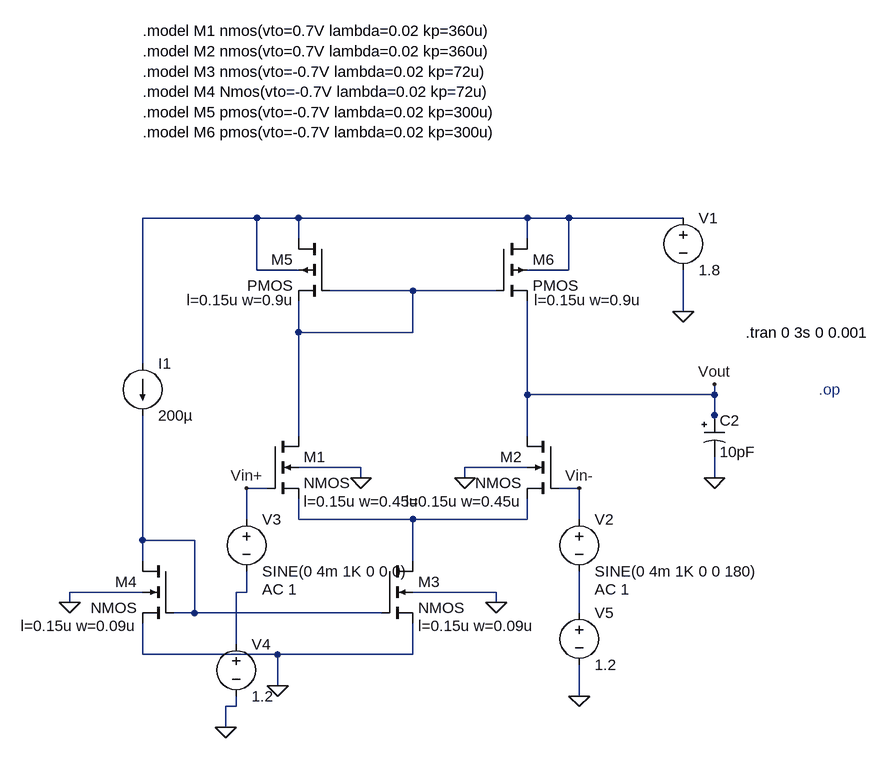
[diagram p0: schematic otaschematic.asc]
otaschematic.asc, the LTspice schematic file:
Version 4
SHEET 1 1068 704
WIRE 64 -192 -112 -192
WIRE 128 -192 64 -192
WIRE 480 -192 128 -192
WIRE 544 -192 480 -192
WIRE 720 -192 544 -192
WIRE 128 -160 128 -192
WIRE 480 -160 480 -192
WIRE 64 -112 64 -192
WIRE 128 -112 64 -112
WIRE 544 -112 544 -192
WIRE 544 -112 480 -112
WIRE 304 -80 176 -80
WIRE 432 -80 304 -80
WIRE 720 -48 720 -112
WIRE 128 -16 128 -64
WIRE 304 -16 304 -80
WIRE 304 -16 128 -16
WIRE -112 32 -112 -192
WIRE 480 80 480 -64
WIRE 768 80 768 64
WIRE 768 80 480 80
WIRE 768 112 768 80
WIRE 768 128 768 112
WIRE 128 144 128 -16
WIRE 480 144 480 80
WIRE 224 192 128 192
WIRE 480 192 384 192
WIRE 224 208 224 192
WIRE 384 208 384 192
WIRE 768 208 768 176
WIRE 80 224 48 224
WIRE 560 224 528 224
WIRE 48 272 48 224
WIRE 128 272 128 240
WIRE 304 272 128 272
WIRE 480 272 480 240
WIRE 480 272 304 272
WIRE 560 272 560 224
WIRE -112 304 -112 112
WIRE -32 304 -112 304
WIRE -112 336 -112 304
WIRE 304 336 304 272
WIRE -112 384 -224 384
WIRE 48 384 48 352
WIRE 48 384 32 384
WIRE 432 384 304 384
WIRE -224 400 -224 384
WIRE 432 400 432 384
WIRE -32 416 -32 304
WIRE -32 416 -64 416
WIRE 256 416 -32 416
WIRE 560 416 560 352
WIRE 32 464 32 384
WIRE -112 480 -112 432
WIRE 96 480 -112 480
WIRE 304 480 304 432
WIRE 304 480 96 480
WIRE 96 528 96 480
WIRE 560 544 560 496
WIRE 32 560 32 544
WIRE 32 560 16 560
WIRE 16 592 16 560
FLAG 720 -48 0
FLAG 96 528 0
FLAG -224 400 0
FLAG 432 400 0
FLAG 224 208 0
FLAG 384 208 0
FLAG 768 208 0
FLAG 768 64 Vout
FLAG 48 224 Vin+
FLAG 560 224 Vin-
FLAG 16 592 0
FLAG 560 544 0
SYMBOL nmos4 80 144 R0
WINDOW 123 56 100 Left 2
SYMATTR Value2 l=0.15u w=0.45u
SYMATTR InstName M1
SYMBOL nmos4 528 144 M0
WINDOW 123 56 100 Left 2
SYMATTR Value2 l=0.15u w=0.45u
SYMATTR InstName M2
SYMBOL nmos4 256 336 R0
WINDOW 123 56 100 Left 2
SYMATTR Value2 l=0.15u w=0.09u
SYMATTR InstName M3
SYMBOL nmos4 -64 336 M0
WINDOW 123 56 100 Left 2
SYMATTR Value2 l=0.15u w=0.09u
SYMATTR InstName M4
SYMBOL pmos4 176 -160 M0
WINDOW 123 54 94 Left 2
SYMATTR Value2 l=0.15u w=0.9u
SYMATTR InstName M5
SYMBOL pmos4 432 -160 R0
WINDOW 123 59 94 Left 2
SYMATTR Value2 l=0.15u w=0.9u
SYMATTR InstName M6
SYMBOL current -112 32 R0
WINDOW 123 0 0 Left 0
WINDOW 39 0 0 Left 0
SYMATTR InstName I1
SYMATTR Value 200µ
SYMBOL voltage 720 -208 R0
SYMATTR InstName V1
SYMATTR Value 1.8
SYMBOL polcap 752 112 R0
SYMATTR InstName C2
SYMATTR Value 10pF
SYMBOL voltage 560 256 R0
WINDOW 123 24 124 Left 2
WINDOW 39 0 0 Left 0
SYMATTR Value2 AC 1
SYMATTR InstName V2
SYMATTR Value SINE(0 4m 1K 0 0 180)
SYMBOL voltage 48 256 R0
WINDOW 123 24 124 Left 2
WINDOW 39 0 0 Left 0
SYMATTR Value2 AC 1
SYMATTR InstName V3
SYMATTR Value SINE(0 4m 1K 0 0 0)
SYMBOL voltage 32 448 R0
WINDOW 123 0 0 Left 0
WINDOW 39 0 0 Left 0
SYMATTR InstName V4
SYMATTR Value 1.2
SYMBOL voltage 560 400 R0
WINDOW 123 0 0 Left 0
WINDOW 39 0 0 Left 0
SYMATTR InstName V5
SYMATTR Value 1.2
TEXT 816 -16 Left 2 !.tran 0 3s 0 0.001
TEXT -112 -480 Left 2 !.model M1 nmos(vto=0.7V lambda=0.02 kp=360u)\n.model M2 nmos(vto=0.7V lambda=0.02 kp=360u)\n.model M3 nmos(vto=-0.7V lambda=0.02 kp=72u)\n.model M4 Nmos(vto=-0.7V lambda=0.02 kp=72u)\n.model M5 pmos(vto=-0.7V lambda=0.02 kp=300u)\n.model M6 pmos(vto=-0.7V lambda=0.02 kp=300u)
TEXT 928 72 Left 2 ;.op

The netlist it stands for:
* otaschematic.asc
M1 N002 Vin+ N003 0 NMOS l=0.15u w=0.45u
M2 Vout Vin- N003 0 NMOS l=0.15u w=0.45u
M3 N003 N004 0 0 NMOS l=0.15u w=0.09u
M4 N004 N004 0 0 NMOS l=0.15u w=0.09u
M5 N001 N002 N002 N001 PMOS l=0.15u w=0.9u
M6 N001 N002 Vout N001 PMOS l=0.15u w=0.9u
I1 N001 N004 200µ
V1 N001 0 1.8
C2 Vout 0 10pF
V2 Vin- N006 SINE(0 4m 1K 0 0 180) AC 1
V3 Vin+ N005 SINE(0 4m 1K 0 0 0) AC 1
V4 N005 0 1.2
V5 N006 0 1.2
.model NMOS NMOS
.model PMOS PMOS
.lib standard.mos
.tran 0 3s 0 0.001
.model M1 nmos(vto=0.7V lambda=0.02 kp=360u)
.model M2 nmos(vto=0.7V lambda=0.02 kp=360u)
.model M3 nmos(vto=-0.7V lambda=0.02 kp=72u)
.model M4 Nmos(vto=-0.7V lambda=0.02 kp=72u)
.model M5 pmos(vto=-0.7V lambda=0.02 kp=300u)
.model M6 pmos(vto=-0.7V lambda=0.02 kp=300u)
* .op
.backanno
.end